# Altium schematic sheet CH340T3R-R0.SchDoc
size 177 x 177 mm; SheetNumber: 0; SheetTotal: 0
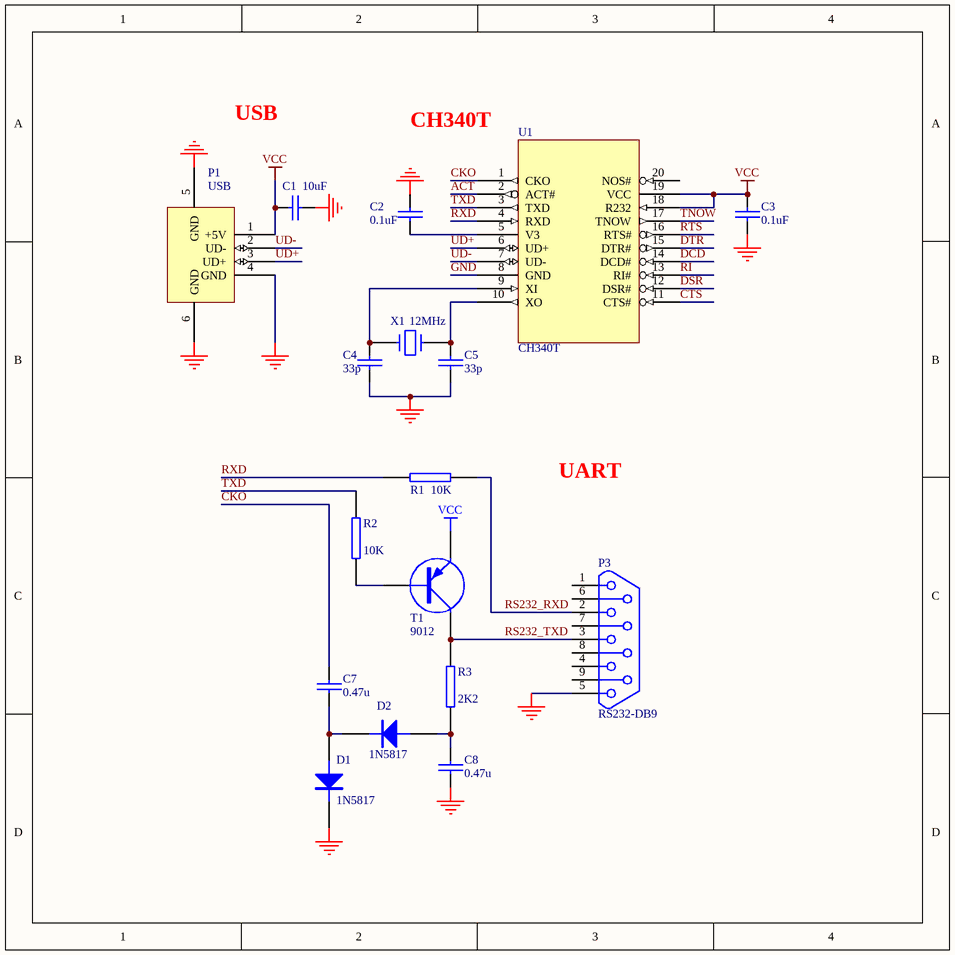
[diagram p0: CH340T3R-R0.SchDoc]

## Parts
C1  10uF  [3216_C]
C2  0.1uF  [0603_C]
C3  0.1uF  [0603_C]
C4  33p  [0603_C]
C5  33p  [0603_C]
C7  0.47u  [0603_C]
C8  0.47u  [0603_C]
D1  1N5817  [7227+]
D2  1N5817  [7227+]
P1  USB  [USBAM]
P3  RS232-DB9  [DB9-PAD-M]
R1  10K  [0603]
R2  10K  [0603]
R3  2K2  [0603]
T1  9012  [SOT-23]
U1  CH340T  [SSOP20]
X1  12MHz  [XT3225]

## Nets
GND: C1.2 C2.2 C3.2 C4.2 C5.2 C8.2 D1.2(K) P1.4(GND) P1.5(GND) P1.6(GND) P3.5 U1.8(GND)
VCC: C1.1 C3.1 P1.1(+5V) T1.2(E) U1.18(R232) U1.19(VCC)
ACT: U1.2(ACT#)
CKO: C7.2 U1.1(CKO)
CTS: U1.11(CTS#)
DCD: U1.14(DCD#)
DSR: U1.12(DSR#)
DTR: U1.15(DTR#)
RI: U1.13(RI#)
RS232_RXD: P3.2 R1.2
RS232_TXD: P3.3 R3.2 T1.3(C)
RTS: U1.16(RTS#)
RXD: R1.1 U1.4(RXD)
TNOW: U1.17(TNOW)
TXD: R2.2 U1.3(TXD)
UD+: P1.3(UD+) U1.6(UD+)
UD-: P1.2(UD-) U1.7(UD-)
NetC2_1: C2.1 U1.5(V3)
NetC4_1: C4.1 U1.9(XI) X1.1
NetC5_1: C5.1 U1.10(XO) X1.3
NetC7_1: C7.1 D1.1(A) D2.2(K)
NetC8_1: C8.1 D2.1(A) R3.1
NetR2_1: R2.1 T1.1(B)

Not connected (* = marked no-connect by the designer): P3 1 4 6 7 8 9; U1 20(NOS#)

## Notes on the sheet
- USB
- CH340T
- UART

## Library data of the parts
C1-C5 = CAP: Capacitor
C7 C8 = CPA
D1 D2 = DIODE
P3 = DB9
R1-R3 = RES2
T1 = PNP: PNP Transistor
U1 = CH340T: USB to TTL Serial / UART,  USB to IrDA
X1 = CRYSTAL